# Altium schematic sheet 03_ClockDiagram.SchDoc: Clock diagram
size A4; Organization: Lime Microsystems; Address1: Surrey Tech Centre; Address2: Guildford GU2 7YG; Address3: Surrey; Address4: United Kingdom; Revision: v1.0; SheetNumber: 3; SheetTotal: 9
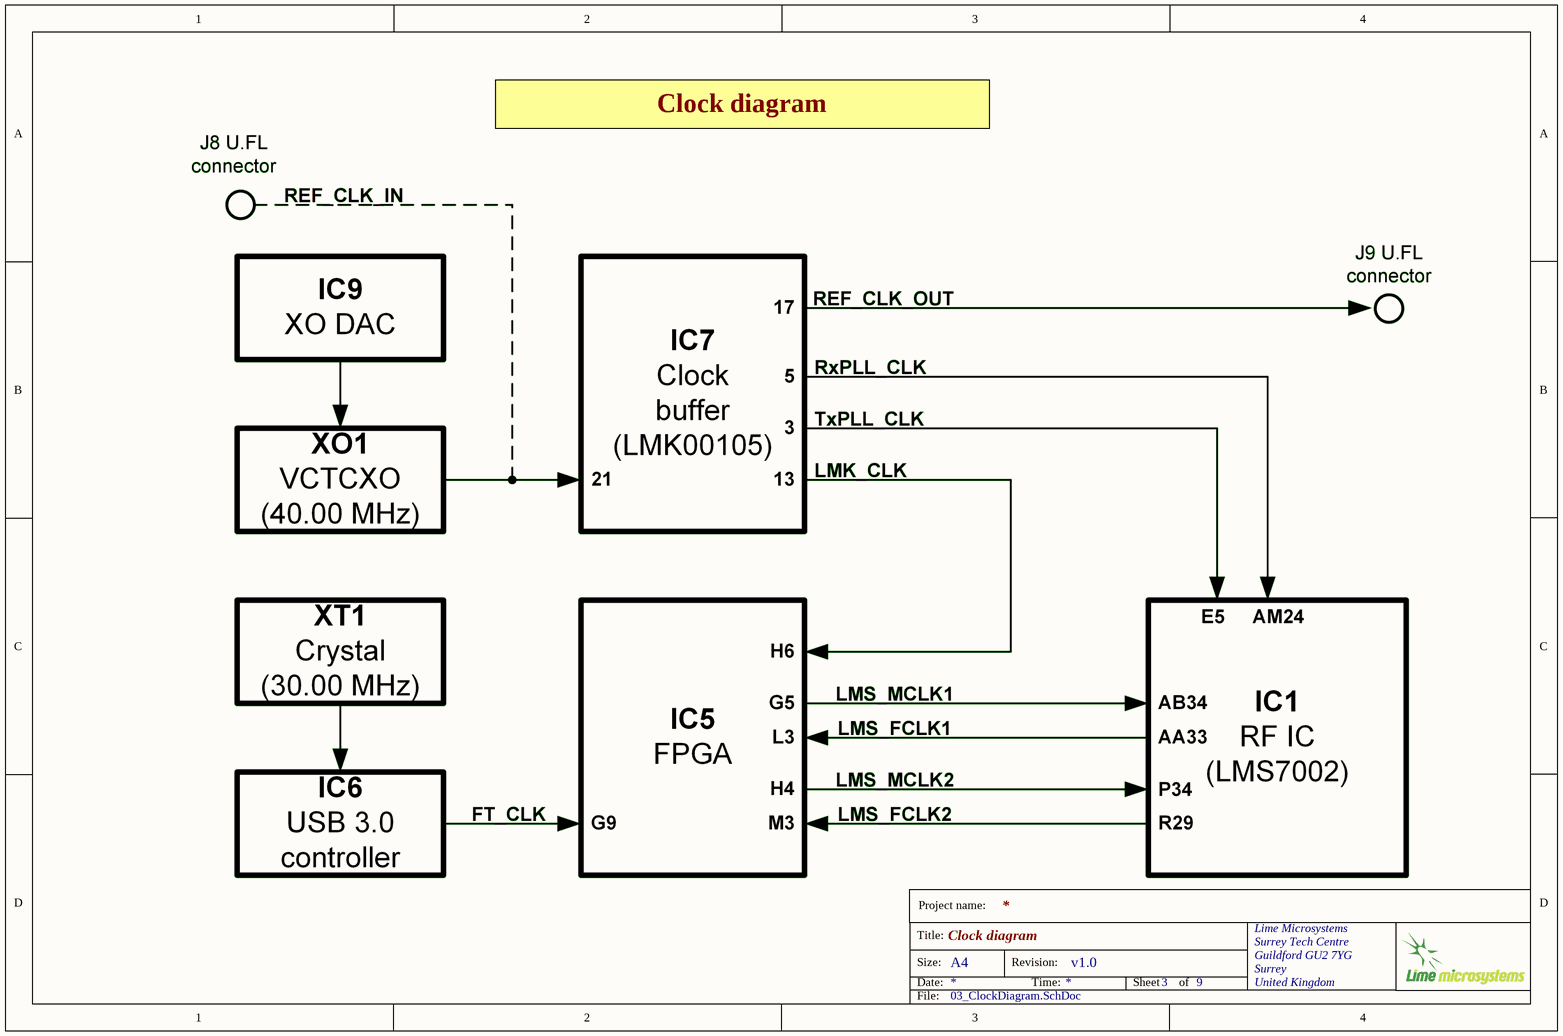
[diagram p0: 03_ClockDiagram.SchDoc]

## Notes on the sheet
- Clock diagram
- Project name:
- Title:
- Size:
- Date:
- A4
- Revision:
- Time:
- Sheet
- of
- File: